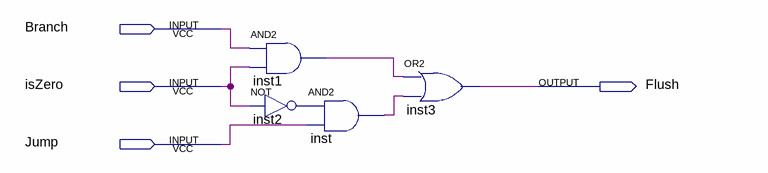
[diagram p0: schematic sheet]
// Quartus schematic FlushUnit.bdf as structural Verilog: 4 symbols, 4 pins
module FlushUnit (
  input  Branch,
  input  isZero,
  input  Jump,
  output Flush
);

  wire inst1_out, inst2_out, inst_out;

  and inst1 (inst1_out, Branch, isZero);
  not inst2 (inst2_out, isZero);
  and inst (inst_out, inst2_out, Jump);
  or inst3 (Flush, inst1_out, inst_out);
endmodule
